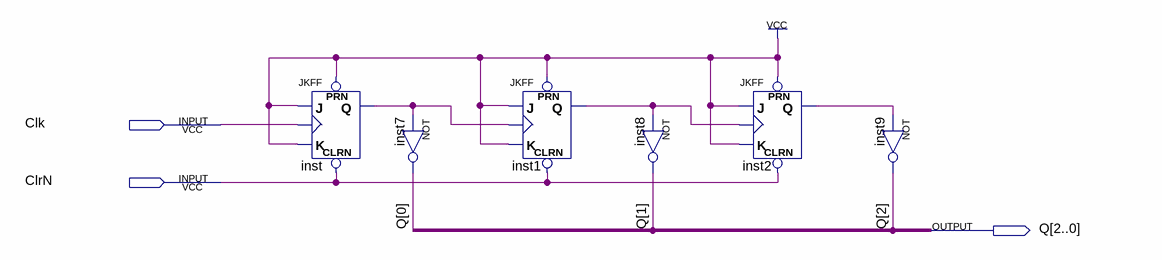
[diagram p0: schematic sheet]
// Quartus schematic 3bitsRippleDown.bdf as structural Verilog: 6 symbols, 3 pins
module \3bitsRippleDown  (
  input  Clk,
  input  ClrN,
  output [2:0] Q
);

  wire inst1_q, inst2_q, inst_q;

  JKFF inst (.PRN(1'b1), .CLRN(ClrN), .K(1'b1), .J(1'b1), .CLK(Clk), .Q(inst_q));
  not inst7 (Q[0], inst_q);
  JKFF inst1 (.PRN(1'b1), .CLRN(ClrN), .K(1'b1), .J(1'b1), .CLK(inst_q), .Q(inst1_q));
  not inst8 (Q[1], inst1_q);
  JKFF inst2 (.PRN(1'b1), .CLRN(ClrN), .K(1'b1), .J(1'b1), .CLK(inst1_q), .Q(inst2_q));
  not inst9 (Q[2], inst2_q);
endmodule
